# Altium schematic sheet FOTA Microcontroller Power Switch.SchDoc: FOTA MicroController Latched Power Trigger
size 292 x 193 mm; SheetNumber: 24; SheetTotal: 28
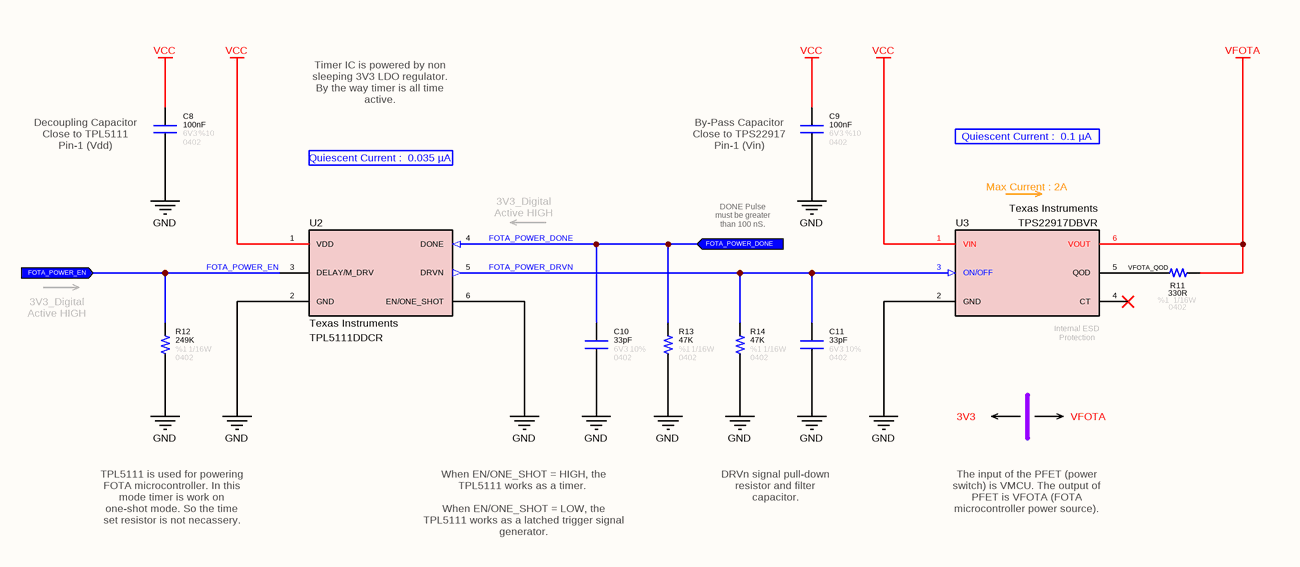
[diagram p0: FOTA Microcontroller Power Switch.SchDoc]

## Parts
C8  value 100nF  Tolerance: %10  Voltage: 6V3  Case: 0402  [CAPACITOR_0402]  (hidden comment: Capacitor - 100nF [0402] (Ceramic))
C9  value 100nF  Tolerance: %10  Voltage: 6V3  Case: 0402  [CAPACITOR_0402]  (hidden comment: Capacitor - 100nF [0402] (Ceramic))
C10  value 33pF  Tolerance: 10%  Case: 0402  Voltage: 6V3  [CAPACITOR_0402]  (hidden comment: Capacitor - 33pF [0402] (Ceramic))
C11  value 33pF  Tolerance: 10%  Case: 0402  Voltage: 6V3  [CAPACITOR_0402]  (hidden comment: Capacitor - 33pF [0402] (Ceramic))
R11  value 330R  Case: 0402  Tolerance: %1  Power: 1/16W  [RESISTOR_0402]  (hidden comment: 330R - 0402 - %1 - 1/16W)
R12  value 249K  Power: 1/16W  Case: 0402  Tolerance: %1  [RESISTOR_0402]  (hidden comment: 249K - 0402 - %1 - 1/16W)
R13  value 47K  Tolerance: %1  Case: 0402  Power: 1/16W  [RESISTOR_0402]  (hidden comment: 47K - 0402 - %1 - 1/16W)
R14  value 47K  Tolerance: %1  Case: 0402  Power: 1/16W  [RESISTOR_0402]  (hidden comment: 47K - 0402 - %1 - 1/16W)
U2  Manufacturer Name: Texas Instruments  [SOT-23-6]  (hidden comment: TPL5111DDCR)
U3  Manufacturer Part Number: TPS22917DBVR  Manufacturer Name: Texas Instruments  [SOT-23-6]  (hidden comment: Power Switch)

## Ports
FOTA_POWER_DONE (in), FOTA_POWER_EN (in)

## Nets
GND: C8.1 C9.1 C10.1 C11.1 R12.1 R13.1 R14.1 U2.2(GND) U2.6(EN/ONE_SHOT) U3.2(GND)
VCC: C8.2 C9.2 U2.1(VDD) U3.1(VIN)
VFOTA: R11.1 U3.6(VOUT)
FOTA_POWER_DONE: C10.2 R13.2 U2.4(DONE) ; port FOTA_POWER_DONE
FOTA_POWER_DRVN: C11.2 R14.2 U2.5(DRVN) U3.3(ON/OFF)
FOTA_POWER_EN: R12.2 U2.3(DELAY/M_DRV) ; port FOTA_POWER_EN
VFOTA_QOD: R11.2 U3.5(QOD)

Not connected (* = marked no-connect by the designer): U3 4(CT)*

## Notes on the sheet
- (near C8) Decoupling Capacitor
  Close to TPL5111
  Pin-1 (Vdd)
- Quiescent Current :  0.035 µA
- Timer IC is powered by non sleeping 3V3 LDO regulator. By the way timer is all time active.
- (near C9) By-Pass Capacitor
  Close to TPS22917
  Pin-1 (Vin)
- Quiescent Current :  0.1 µA
- (near U2) 3V3_Digital
  Active HIGH
- DONE Pulse must be greater than 100 nS.
- (near U3) Max Current : 2A
- 3V3_Digital
  Active HIGH
- (near U3) Internal ESD Protection
- 3V3
- VFOTA
- DRVn signal pull-down resistor and filter capacitor.
- TPL5111 is used for powering FOTA microcontroller. In this mode timer is work on one-shot mode. So the time set resistor is not necassery.
- When EN/ONE_SHOT = HIGH, the TPL5111 works as a timer.
  When EN/ONE_SHOT = LOW, the TPL5111 works as a latched trigger signal generator.
- The input of the PFET (power switch) is VMCU. The output of PFET is VFOTA (FOTA microcontroller power source).
- © 2021 All rights reserved.
  This document may not, in whole or in part, be copied, photocopied, reproduced, translated or converted to any electronic or machine readable from without prior written permission of Mehmet Günce Akkoyun.
  Engineer contact : akkoyun@me.com
- Property of
- Engineer :
- Date :
- Size :
- A4
- Time :
- Project :
- Page :
- /
- Customer :
- Product ID :
- Module ID :
- Version :
- File :
- Revision :

## Library data of the parts
C8 C9 = Capacitor - 100nF [0402-6V3]: Capacitor - 100nF [0402-6V3] (Ceramic); Manufacturer Name: AVX; Manufacturer Part Number: 04026D104KAT4A; ComponentLink1Description: Mouser; ComponentLink1URL: https://www.mouser.com.tr/ProductDetail/AVX/04026D104KAT4A?qs=sGAEpiMZZMs0AnBnWHyRQPg4iYkCw7IMED%2F4kpqgf7w%3D; ComponentLink2Description: DataSheet; ComponentLink2URL: https://www.mouser.com.tr/datasheet/2/40/cx5r-776519.pdf
C10 C11 = Capacitor - 33pF [0402-6V3]: Manufacturer Name: Kemet; Manufacturer Part Number: C0402C330J9RACAUTO; ComponentLink1Description: DataSheet; ComponentLink1URL: https://api.kemet.com/component-edge/download/datasheet/C0402C330J9RACAUTO.pdf; ComponentLink2Description: Mouser; ComponentLink2URL: https://www.mouser.com/Search/Refine.aspx?Keyword=80-C0402C330J9RAUTO
R11 = Resistor - 330R [0402]: Thick Film Resistors - SMD 1/16 W 330 Ohm 1%; Manufacturer Name: Vishay; Manufacturer Part Number: CRCW0402330RFKED; ComponentLink1Description: DataSheet; ComponentLink1URL: https://www.mouser.com.tr/datasheet/2/427/dcrcwe3-1762152.pdf; ComponentLink2Description: Mouser; ComponentLink2URL: https://www.mouser.com.tr/ProductDetail/Vishay-Dale/CRCW0402330RFKED?qs=sGAEpiMZZMu61qfTUdNhG2DpbjADlD3GGS6SwBlLi5Q%3D
R12 = Resistor - 249K [0402]: Thick Film Resistors - SMD 1/16 W 249 KOhm 1%; Manufacturer Name: Vishay; Manufacturer Part Number: CRCW0402249KFKED
R13 R14 = Resistor - 47K [0402]: Thick Film Resistors - SMD 1/16 W 47 KOhm 1%; Manufacturer Name: Vishay; Manufacturer Part Number: CRCW040247K0FKED; ComponentLink1Description: DataSheet; ComponentLink1URL: https://www.mouser.com.tr/datasheet/2/427/dcrcwe3-1762152.pdf; ComponentLink2Description: Mouser; ComponentLink2URL: https://www.mouser.com.tr/ProductDetail/Vishay-Dale/CRCW040247K0FKED?qs=sGAEpiMZZMu61qfTUdNhG2DpbjADlD3GL%252B3h1elTxqU%3D
U2 = IC - TPL5111: NANO-POWER SYSTEM TIMER FOR POWE; Maximum Operating Temperature: + 105 C; Minimum Operating Temperature: - 40 C; RoHS: Yes; Case: SOT-23-6; Product Type: Timers; Manufacturer Part Number: TPL5111DDCR
U3 = IC - TPS22917: Power Switch MosFet; Height: 1.45mm; ComponentLink1Description: DataSheet; ComponentLink1URL: http://www.ti.com/lit/gpn/tps22917; ComponentLink2Description: Mouser; ComponentLink2URL: https://www.mouser.com/Search/Refine.aspx?Keyword=595-TPS22917DBVR; Case: SOT-23-6